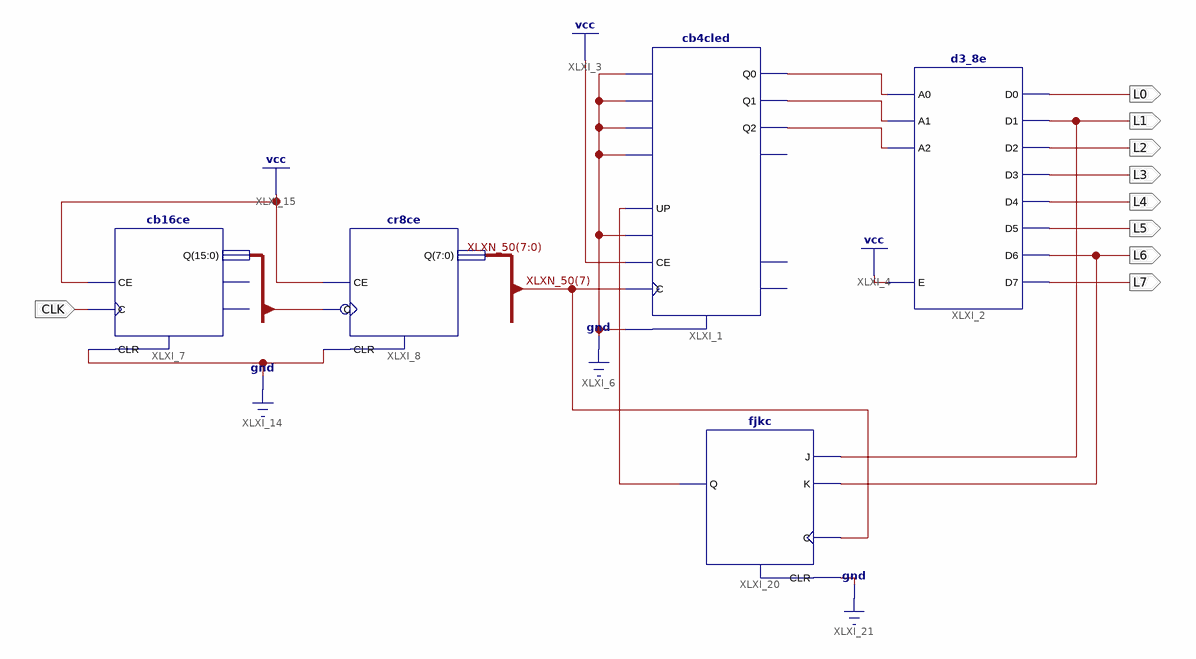
[diagram p0: schematic sheet 1]
// Xilinx ISE schematic Pendulo.sch (spartan3e) as structural Verilog: 5 symbols, 9 ports
module Pendulo (
  input  CLK,
  output L7,
  output L6,
  output L5,
  output L4,
  output L3,
  output L2,
  output L1,
  output L0
);

  wire XLXN_6, XLXN_7, XLXN_8, XLXN_70;
  wire [7:0] XLXN_50;
  wire [15:0] XLXN_52;

  cr8ce XLXI_8 (.C(XLXN_52[15]), .CE(1'b1), .CLR(1'b0), .Q(XLXN_50));
  cb4cled XLXI_1 (
    .C(XLXN_50[7]), .CE(1'b1), .CLR(1'b0), .D0(1'b0), .D1(1'b0), .D2(1'b0), .D3(1'b0), .L(1'b0),
    .UP(XLXN_70), .Q0(XLXN_6), .Q1(XLXN_7), .Q2(XLXN_8));  // open: CEO, Q3, TC
  d3_8e XLXI_2 (
    .A0(XLXN_6), .A1(XLXN_7), .A2(XLXN_8), .E(1'b1), .D0(L0), .D1(L1), .D2(L2), .D3(L3), .D4(L4), .D5(L5),
    .D6(L6), .D7(L7));
  cb16ce XLXI_7 (.C(CLK), .CE(1'b1), .CLR(1'b0), .Q(XLXN_52));  // open: CEO, TC
  fjkc XLXI_20 (.C(XLXN_50[7]), .CLR(1'b0), .J(L1), .K(L6), .Q(XLXN_70));
endmodule
